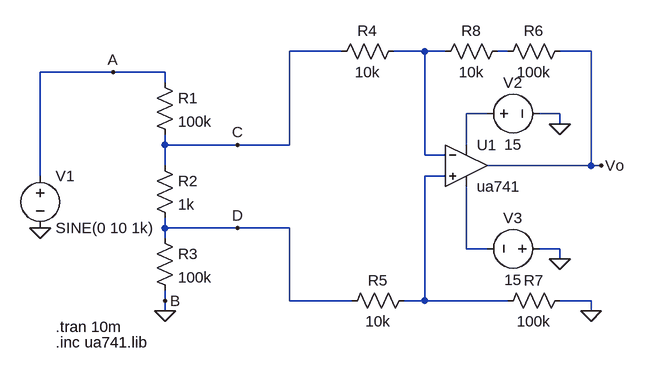
[diagram p0: schematic Draft1.asc]
Draft1.asc, the LTspice schematic file:
Version 4
SHEET 1 1060 680
WIRE 448 0 368 0
WIRE 576 0 528 0
WIRE 608 0 576 0
WIRE 704 0 688 0
WIRE 832 0 784 0
WIRE 96 32 -16 32
WIRE 176 32 96 32
WIRE 176 48 176 32
WIRE 672 96 640 96
WIRE 784 96 752 96
WIRE 784 112 784 96
WIRE 176 144 176 128
WIRE 288 144 176 144
WIRE 368 144 368 0
WIRE 368 144 288 144
WIRE 640 144 640 96
WIRE 576 160 576 0
WIRE 608 160 576 160
WIRE 176 176 176 144
WIRE 832 176 832 0
WIRE 832 176 672 176
WIRE 848 176 832 176
WIRE -16 192 -16 32
WIRE 608 192 576 192
WIRE 176 272 176 256
WIRE 288 272 176 272
WIRE 368 272 288 272
WIRE 176 288 176 272
WIRE 640 304 640 208
WIRE 672 304 640 304
WIRE 784 304 752 304
WIRE 784 320 784 304
WIRE 176 384 176 368
WIRE 368 384 368 272
WIRE 464 384 368 384
WIRE 576 384 576 192
WIRE 576 384 544 384
WIRE 704 384 576 384
WIRE 832 384 784 384
WIRE 176 400 176 384
WIRE 832 400 832 384
FLAG 288 144 C
FLAG 288 272 D
FLAG 96 32 A
FLAG 176 400 0
FLAG -16 272 0
FLAG 176 384 B
FLAG 784 320 0
FLAG 848 176 Vo
FLAG 784 112 0
FLAG 832 400 0
SYMBOL res 160 32 R0
SYMATTR InstName R1
SYMATTR Value 100k
SYMBOL res 160 160 R0
SYMATTR InstName R2
SYMATTR Value 1k
SYMBOL res 160 272 R0
SYMATTR InstName R3
SYMATTR Value 100k
SYMBOL voltage -16 176 R0
WINDOW 123 0 0 Left 0
WINDOW 39 0 0 Left 0
SYMATTR InstName V1
SYMATTR Value SINE(0 10 1k)
SYMBOL res 544 -16 R90
WINDOW 0 0 56 VBottom 2
WINDOW 3 32 56 VTop 2
SYMATTR InstName R4
SYMATTR Value 10k
SYMBOL res 560 368 R90
WINDOW 0 0 56 VBottom 2
WINDOW 3 32 56 VTop 2
SYMATTR InstName R5
SYMATTR Value 10k
SYMBOL res 800 -16 R90
WINDOW 0 0 56 VBottom 2
WINDOW 3 32 56 VTop 2
SYMATTR InstName R6
SYMATTR Value 100k
SYMBOL res 800 368 R90
WINDOW 0 0 56 VBottom 2
WINDOW 3 32 56 VTop 2
SYMATTR InstName R7
SYMATTR Value 100k
SYMBOL OpAmps\\ua741 640 112 R0
SYMATTR InstName U1
SYMBOL voltage 656 96 R270
WINDOW 0 32 56 VTop 2
WINDOW 3 -32 56 VBottom 2
WINDOW 123 0 0 Left 0
WINDOW 39 0 0 Left 0
SYMATTR InstName V2
SYMATTR Value 15
SYMBOL voltage 768 304 R90
WINDOW 0 -32 56 VBottom 2
WINDOW 3 32 56 VTop 2
WINDOW 123 0 0 Left 0
WINDOW 39 0 0 Left 0
SYMATTR InstName V3
SYMATTR Value 15
SYMBOL res 704 -16 R90
WINDOW 0 0 56 VBottom 2
WINDOW 3 32 56 VTop 2
SYMATTR InstName R8
SYMATTR Value 10k
TEXT 8 424 Left 2 !.tran 10m
TEXT 8 448 Left 2 !.inc ua741.lib

The netlist it stands for:
* Draft1.asc
R1 A C 100k
R2 C D 1k
R3 D 0 100k
V1 A 0 SINE(0 10 1k)
R4 N001 C 10k
R5 N004 D 10k
R6 Vo N002 100k
R7 0 N004 100k
XU1 N004 N001 N003 N005 Vo ua741  ; pins In+ In- V+ V- OUT
V2 N003 0 15
V3 0 N005 15
R8 N002 N001 10k
.tran 10m
.inc ua741.lib
.backanno
.end